# Altium schematic sheet CELL_SENSE.SchDoc
size A; SheetNumber: 7; SheetTotal: 11
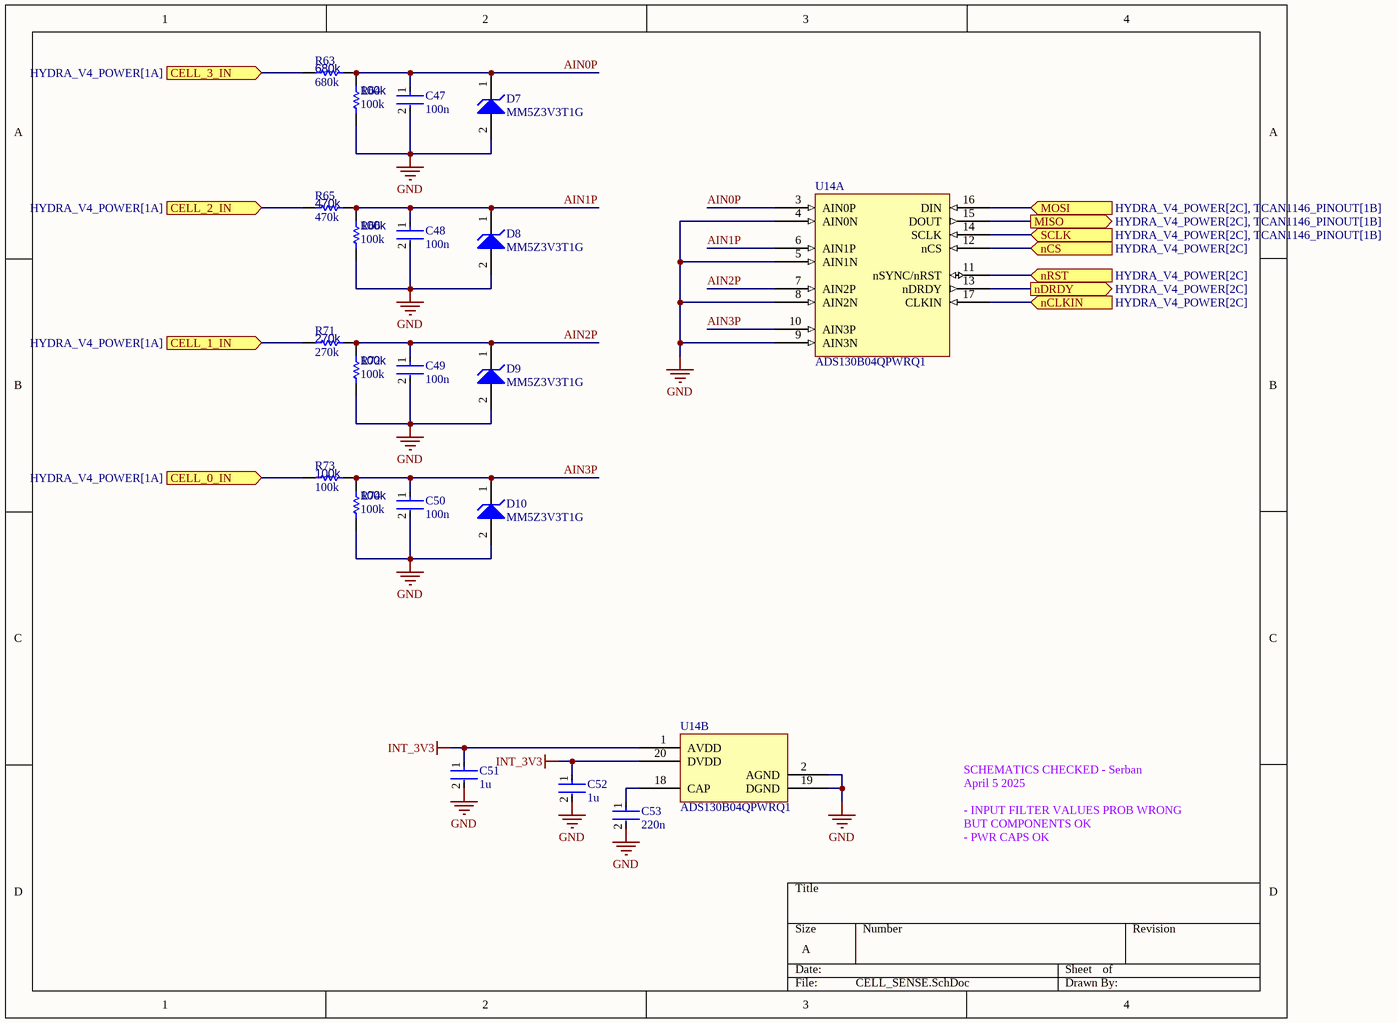
[diagram p0: CELL_SENSE.SchDoc]

## Parts
C47  100n  [FP-0402-L_1_0_0_05-W_0_5-IPC_A]
C48  100n  [FP-0402-L_1_0_0_05-W_0_5-IPC_A]
C49  100n  [FP-0402-L_1_0_0_05-W_0_5-IPC_A]
C50  100n  [FP-0402-L_1_0_0_05-W_0_5-IPC_A]
C51  1u  [FP-0402-L_1_0_0_05-W_0_5-IPC_A]
C52  1u  [FP-0402-L_1_0_0_05-W_0_5-IPC_A]
C53  220n  [FP-0402-L_1_0_0_05-W_0_5-IPC_A]
D7  MM5Z3V3T1G  [ONSC-SOD-523-2-502-01_V]
D8  MM5Z3V3T1G  [ONSC-SOD-523-2-502-01_V]
D9  MM5Z3V3T1G  [ONSC-SOD-523-2-502-01_V]
D10  MM5Z3V3T1G  [ONSC-SOD-523-2-502-01_V]
R63  680k  [R0603B]
R64  100k  [R0603B]
R65  470k  [R0603B]
R66  100k  [R0603B]
R71  270k  [R0603B]
R72  100k  [R0603B]
R73  100k  [R0603B]
R74  100k  [R0603B]
U14  ADS130B04QPWRQ1  [TSOP65P640X120-20N]  (parts A,B of 2)

## Ports
CELL_0_IN (in, see HYDRA_V4_POWER[1A]), CELL_1_IN (in, see HYDRA_V4_POWER[1A]), CELL_2_IN (in, see HYDRA_V4_POWER[1A]), CELL_3_IN (in, see HYDRA_V4_POWER[1A]), MISO (out, see HYDRA_V4_POWER[2C], TCAN1146_PINOUT[1B]), MOSI (in, see HYDRA_V4_POWER[2C], TCAN1146_PINOUT[1B]), nCLKIN (in, see HYDRA_V4_POWER[2C]), nCS (in, see HYDRA_V4_POWER[2C]), nDRDY (out, see HYDRA_V4_POWER[2C]), nRST (in, see HYDRA_V4_POWER[2C]), SCLK (in, see HYDRA_V4_POWER[2C], TCAN1146_PINOUT[1B])

## Nets
GND: C47.2 C48.2 C49.2 C50.2 C51.2 C52.2 C53.2 D7.2(A) D8.2(A) D9.2(A) D10.2(A) R64.2 R66.2 R72.2 R74.2 U14.2(AGND) U14.4(AIN0N) U14.5(AIN1N) U14.8(AIN2N) U14.9(AIN3N) U14.19(DGND)
INT_3V3: C51.1 C52.1 U14.1(AVDD) U14.20(DVDD)
AIN0P: C47.1 D7.1(K) R63.1 R64.1 U14.3(AIN0P)
AIN1P: C48.1 D8.1(K) R65.1 R66.1 U14.6(AIN1P)
AIN2P: C49.1 D9.1(K) R71.1 R72.1 U14.7(AIN2P)
AIN3P: C50.1 D10.1(K) R73.1 R74.1 U14.10(AIN3P)
CELL_0_IN: R73.2 ; port CELL_0_IN
CELL_1_IN: R71.2 ; port CELL_1_IN
CELL_2_IN: R65.2 ; port CELL_2_IN
CELL_3_IN: R63.2 ; port CELL_3_IN
MISO: U14.15(DOUT) ; port MISO
MOSI: U14.16(DIN) ; port MOSI
nCLKIN: U14.17(CLKIN) ; port nCLKIN
nCS: U14.12(nCS) ; port nCS
nDRDY: U14.13(nDRDY) ; port nDRDY
nRST: U14.11(nSYNC/nRST) ; port nRST
SCLK: U14.14(SCLK) ; port SCLK
NetC53_1: C53.1 U14.18(CAP)

## Notes on the sheet
- SCHEMATICS CHECKED - Serban
  April 5 2025
  - INPUT FILTER VALUES PROB WRONG BUT COMPONENTS OK
  - PWR CAPS OK

## Library data of the parts
C47-C53 = CMP-001-00058-1: LARGE PADS, 0402 CAP, CHANGE COMMENT TO MATCH REAL P/N; Capacitor Type: Ceramic; Min Operating Temperature: -55°C; Mounting Technology: Surface Mount; Pins: 2; Case/Package: 0402; RoHS Compliant: Yes; Max Operating Temperature: 85°C
  C47-C50: Value: 100n
  C51 C52: Value: 1u
  C53: Value: 220n
D7-D10 = CMP-1060-00750-1: Zener Voltage Regulator, 500 mW, 2-Pin SOD-523, Pb-Free, Tape and Reel; Manufacturer: On Semiconductor; P Max (W): 0.5; VZ Typ (V): 3.3; RoHS: Pb-Free; ComponentLink2Description: Datasheet; PackageReference: SOD-523-2-502-01; DatasheetVersion: Rev. 10; ComponentLink1Description: Manufacturer URL; PackageVersion: Rev. E, 09/2010; ComponentLink3URL: http://www.onsemi.com/pub_link/Collateral/502-01.PDF; ComponentLink2URL: http://www.onsemi.cn/pub_link/Collateral/MM5Z2V4T1-D.PDF; Mounting Technology: Surface Mount; PartNumber: MM5Z3V3T1G; Packing: Tape and Reel; PackageDescription: 2-Pin SOD, Body 1.2 x 0.8 mm; ComponentLink1URL: http://www.onsemi.com/; ComponentLink3Description: Package Specification
R63-R66 R71-R74 = CMP-009-00002-14: Resistor
  R63: Value: 680k
  R64 R66 R72-R74: Value: 100k
  R65: Value: 470k
  R71: Value: 270k
U14 = CMP-015-00014-2: Automotive 16-bit, 32-kSPS, four-channel, simultaneous-sampling, delta-sigma ADC 20-TSSOP -40 to 125